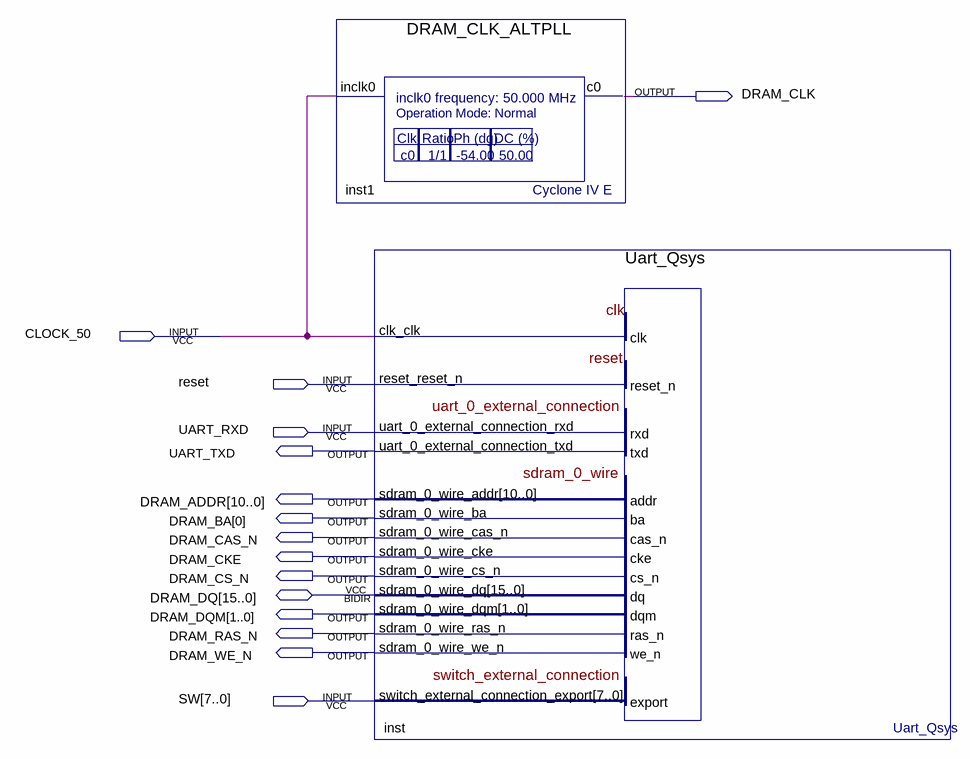
[diagram p0: schematic sheet]
// Quartus schematic Uart_top.bdf as structural Verilog: 2 symbols, 15 pins
module Uart_top (
  input  CLOCK_50,
  input  reset,
  input  UART_RXD,
  input  [7:0] SW,
  inout  [15:0] DRAM_DQ,
  output DRAM_CLK,
  output UART_TXD,
  output [10:0] DRAM_ADDR,
  output [0:0] DRAM_BA,
  output DRAM_CAS_N,
  output DRAM_CKE,
  output DRAM_CS_N,
  output [1:0] DRAM_DQM,
  output DRAM_RAS_N,
  output DRAM_WE_N
);

  DRAM_CLK_ALTPLL inst1 (.inclk0(CLOCK_50), .c0(DRAM_CLK));
  Uart_Qsys inst (
    .clk_clk(CLOCK_50), .reset_reset_n(reset), .uart_0_external_connection_rxd(UART_RXD),
    .switch_external_connection_export(SW), .uart_0_external_connection_txd(UART_TXD),
    .sdram_0_wire_addr(DRAM_ADDR), .sdram_0_wire_ba(DRAM_BA[0]), .sdram_0_wire_cas_n(DRAM_CAS_N),
    .sdram_0_wire_cke(DRAM_CKE), .sdram_0_wire_cs_n(DRAM_CS_N), .sdram_0_wire_dqm(DRAM_DQM),
    .sdram_0_wire_ras_n(DRAM_RAS_N), .sdram_0_wire_we_n(DRAM_WE_N), .sdram_0_wire_dq(DRAM_DQ));
endmodule
